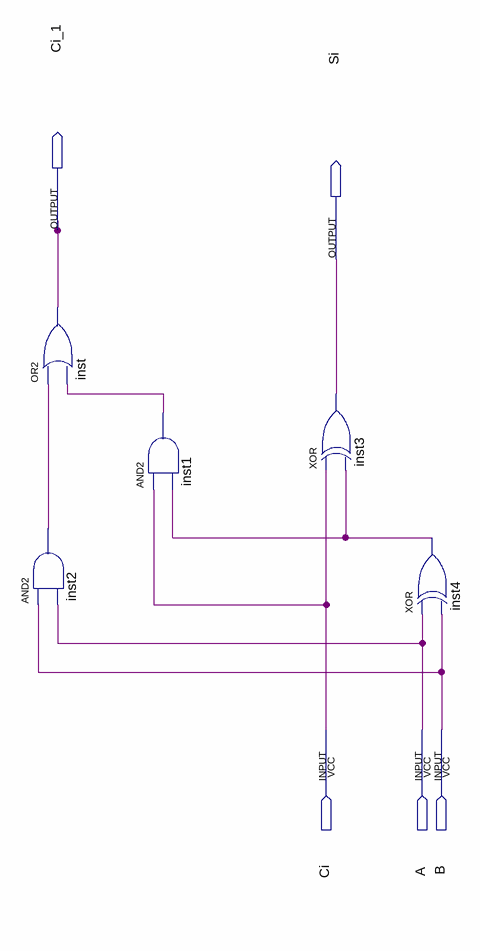
[diagram p0: schematic sheet]
// Quartus schematic FA.bdf as structural Verilog: 5 symbols, 5 pins
module FA (
  input  Ci,
  input  A,
  input  B,
  output Ci_1,
  output Si
);

  wire inst1_out, inst2_out, inst4_out;

  or inst (Ci_1, inst2_out, inst1_out);
  and inst2 (inst2_out, B, A);
  and inst1 (inst1_out, Ci, inst4_out);
  xor inst3 (Si, Ci, inst4_out);
  xor inst4 (inst4_out, A, B);
endmodule
